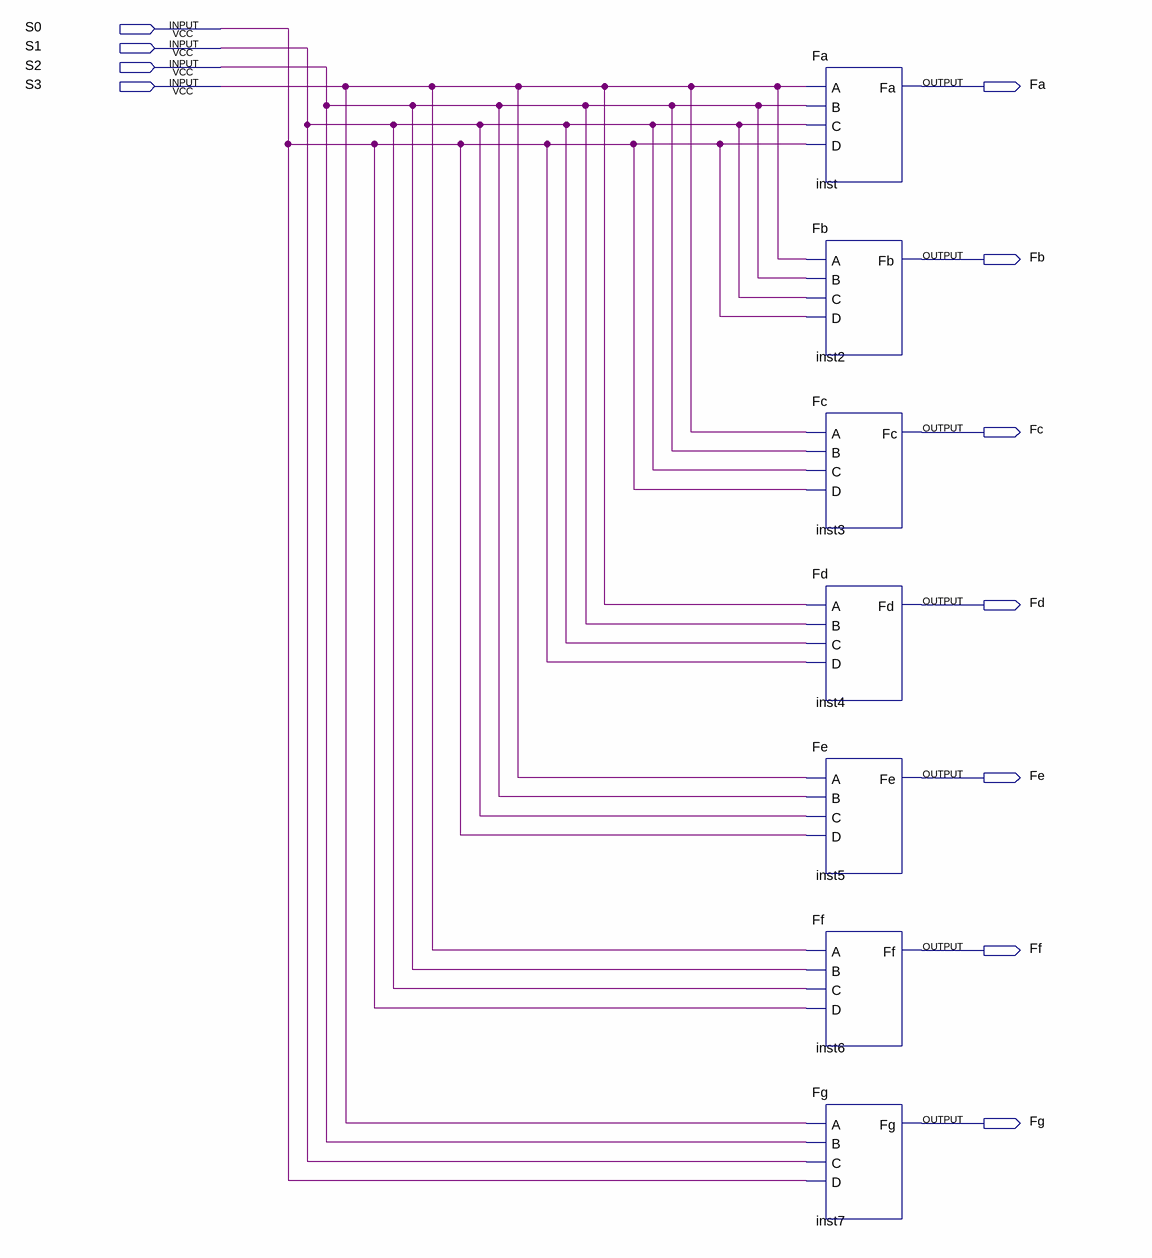
[diagram p0: schematic sheet]
// Quartus schematic binarioHexDecoder.bdf as structural Verilog: 7 symbols, 11 pins
module binarioHexDecoder (
  input  S0,
  input  S1,
  input  S2,
  input  S3,
  output Fa,
  output Fb,
  output Fc,
  output Fd,
  output Fe,
  output Ff,
  output Fg
);

  Fa inst (.A(S3), .B(S2), .C(S1), .D(S0), .Fa(Fa));
  Fb inst2 (.A(S3), .B(S2), .C(S1), .D(S0), .Fb(Fb));
  Fc inst3 (.A(S3), .B(S2), .C(S1), .D(S0), .Fc(Fc));
  Fd inst4 (.A(S3), .B(S2), .C(S1), .D(S0), .Fd(Fd));
  Fe inst5 (.A(S3), .B(S2), .C(S1), .D(S0), .Fe(Fe));
  Ff inst6 (.A(S3), .B(S2), .C(S1), .D(S0), .Ff(Ff));
  Fg inst7 (.A(S3), .B(S2), .C(S1), .D(S0), .Fg(Fg));
endmodule
